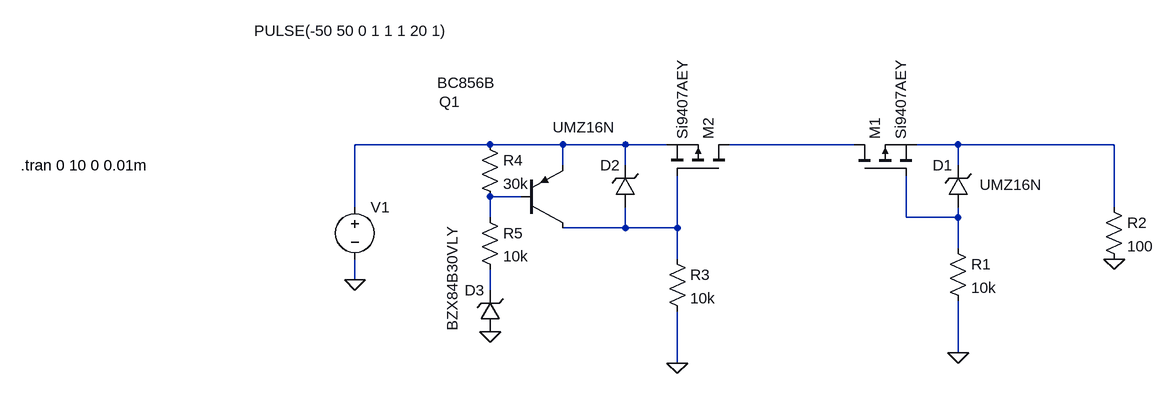
[diagram p0: schematic protection.asc]
protection.asc, the LTspice schematic file:
Version 4
SHEET 1 880 680
WIRE -400 192 -608 192
WIRE -288 192 -400 192
WIRE -192 192 -288 192
WIRE -128 192 -192 192
WIRE 160 192 -32 192
WIRE 320 192 256 192
WIRE 560 192 320 192
WIRE -288 224 -288 192
WIRE -192 224 -192 192
WIRE 320 224 320 192
WIRE -352 272 -400 272
WIRE -608 288 -608 192
WIRE 560 288 560 192
WIRE -400 304 -400 272
WIRE 240 304 240 240
WIRE 320 304 320 288
WIRE 320 304 240 304
WIRE -192 320 -192 288
WIRE -192 320 -288 320
WIRE -112 320 -112 240
WIRE -112 320 -192 320
WIRE 320 352 320 304
WIRE -112 368 -112 320
WIRE -608 400 -608 368
WIRE -400 416 -400 384
WIRE 320 512 320 432
WIRE -112 528 -112 448
FLAG 320 512 0
FLAG 560 368 0
FLAG -608 400 0
FLAG -112 528 0
FLAG -400 480 0
SYMBOL pmos 160 240 R270
SYMATTR InstName M1
SYMATTR Value Si9407AEY
SYMBOL zener 336 288 R180
WINDOW 0 24 64 Left 2
WINDOW 3 -114 34 Left 2
SYMATTR InstName D1
SYMATTR Value UMZ16N
SYMATTR Description Diode
SYMATTR Type diode
SYMBOL res 304 336 R0
SYMATTR InstName R1
SYMATTR Value 10k
SYMBOL res 544 272 R0
SYMATTR InstName R2
SYMATTR Value 100
SYMBOL voltage -608 272 R0
WINDOW 3 -155 -255 Left 2
WINDOW 123 0 0 Left 0
WINDOW 39 0 0 Left 0
SYMATTR InstName V1
SYMATTR Value PULSE(-50 50 0 1 1 1 20 1)
SYMBOL pmos -32 240 M270
SYMATTR InstName M2
SYMATTR Value Si9407AEY
SYMBOL zener -176 288 R180
WINDOW 0 24 64 Left 2
WINDOW 3 31 123 Left 2
SYMATTR InstName D2
SYMATTR Value UMZ16N
SYMATTR Description Diode
SYMATTR Type diode
SYMBOL res -128 352 R0
SYMATTR InstName R3
SYMATTR Value 10k
SYMBOL pnp -352 320 M180
WINDOW 0 -126 194 Left 2
WINDOW 3 -129 223 Left 2
SYMATTR InstName Q1
SYMATTR Value BC856B
SYMBOL zener -384 480 R180
WINDOW 0 24 64 Left 2
WINDOW 3 74 1 VRight 2
SYMATTR InstName D3
SYMATTR Value BZX84B30VLY
SYMATTR Description Diode
SYMATTR Type diode
SYMBOL res -416 176 R0
SYMATTR InstName R4
SYMATTR Value 30k
SYMBOL res -416 288 R0
SYMATTR InstName R5
SYMATTR Value 10k
TEXT -1122 224 Left 2 !.tran 0 10 0 0.01m

The netlist it stands for:
* protection.asc
M1 N002 N005 N003 N003 Si9407AEY
D1 N005 N003 UMZ16N
R1 N005 0 10k
R2 N003 0 100
V1 N001 0 PULSE(-50 50 0 1 1 1 20 1)
M2 N002 N006 N001 N001 Si9407AEY
D2 N006 N001 UMZ16N
R3 N006 0 10k
Q1 N006 N004 N001 0 BC856B
D3 0 N007 BZX84B30VLY
R4 N001 N004 30k
R5 N004 N007 10k
.model D D
.lib standard.dio
.model NPN NPN
.model PNP PNP
.lib standard.bjt
.model NMOS NMOS
.model PMOS PMOS
.lib standard.mos
.tran 0 10 0 0.01m
.backanno
.end